# EAGLE design clock_v0.3 (EAGLE 9.5.0)
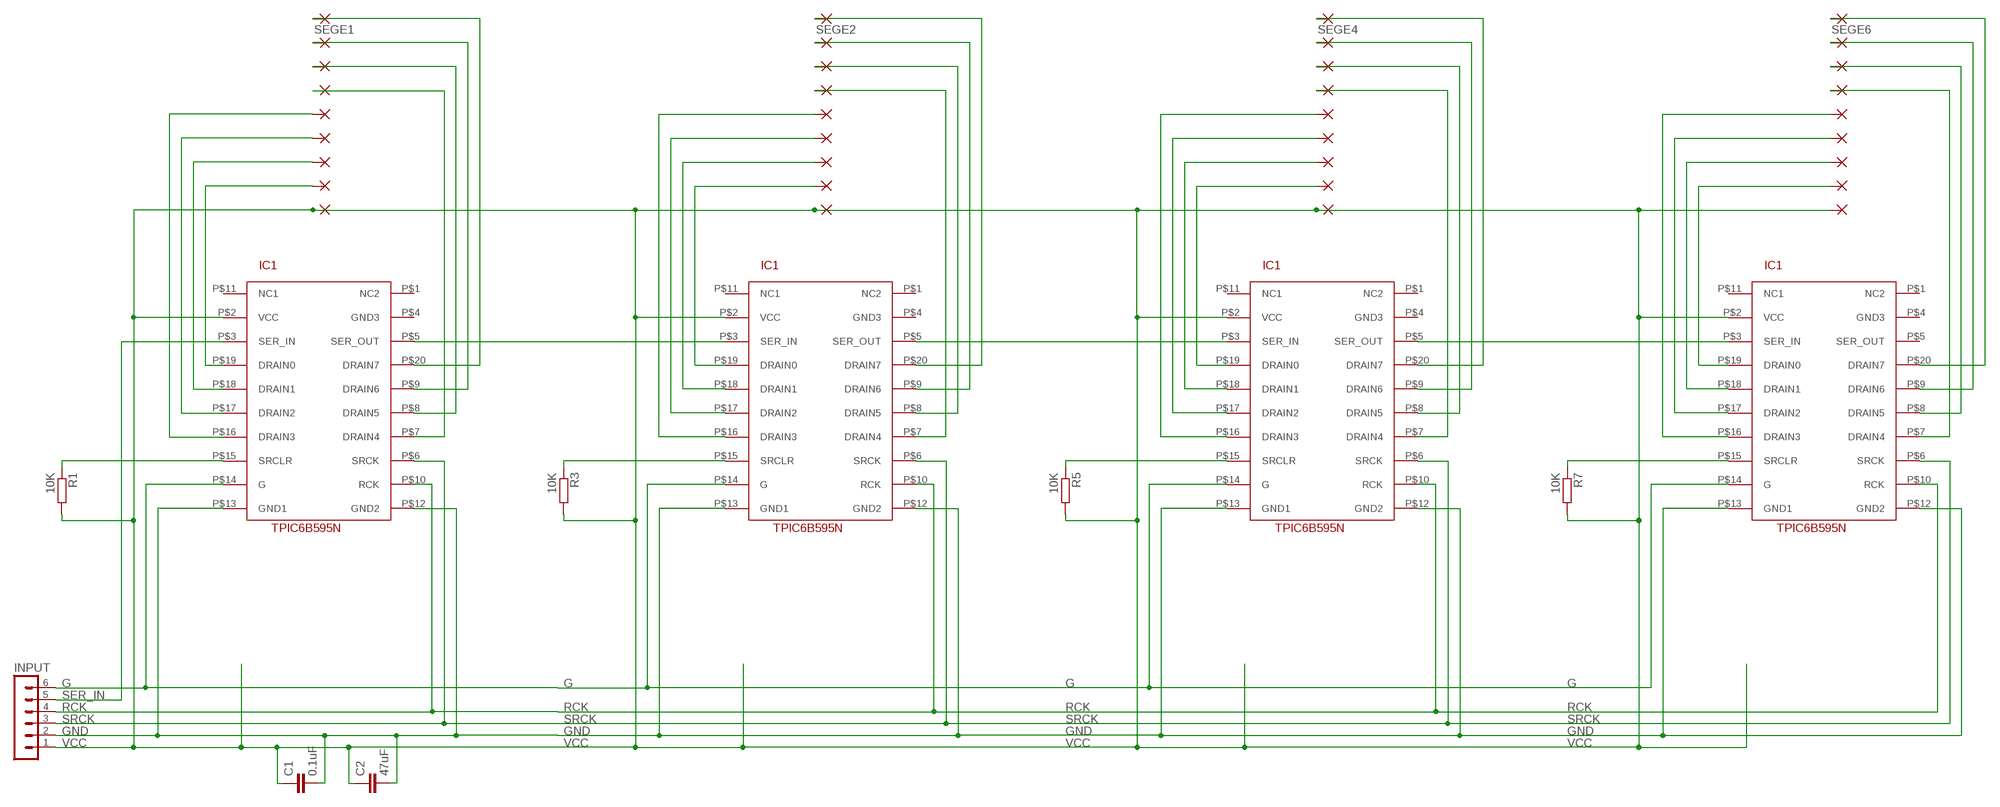
[diagram p0: schematic, sheet 1]

## Parts
C1  0.1uF  RCL_C-EU025-025X050  [RCL_C025-025X050]
C2  47uF  RCL_C-EU025-025X050  [RCL_C025-025X050]
DEC1  1,6/0,8  [1,6/0,8]
DEC2  1,6/0,8  [1,6/0,8]
DEC4  1,6/0,8  [1,6/0,8]
DEC6  1,6/0,8  [1,6/0,8]
INPUT  CON-LSTB_MA06-1  [CON-LSTB_MA06-1]
R1  10K  RCL_R-EU_0207/7  [RCL_0207/7]
R3  10K  RCL_R-EU_0207/7  [RCL_0207/7]
R5  10K  RCL_R-EU_0207/7  [RCL_0207/7]
R7  10K  RCL_R-EU_0207/7  [RCL_0207/7]
SEGA1  1,6/0,8  [1,6/0,8]
SEGA2  1,6/0,8  [1,6/0,8]
SEGA4  1,6/0,8  [1,6/0,8]
SEGA6  1,6/0,8  [1,6/0,8]
SEGB1  1,6/0,8  [1,6/0,8]
SEGB2  1,6/0,8  [1,6/0,8]
SEGB4  1,6/0,8  [1,6/0,8]
SEGB6  1,6/0,8  [1,6/0,8]
SEGC1  1,6/0,8  [1,6/0,8]
SEGC2  1,6/0,8  [1,6/0,8]
SEGC4  1,6/0,8  [1,6/0,8]
SEGC6  1,6/0,8  [1,6/0,8]
SEGD1  1,6/0,8  [1,6/0,8]
SEGD2  1,6/0,8  [1,6/0,8]
SEGD4  1,6/0,8  [1,6/0,8]
SEGD6  1,6/0,8  [1,6/0,8]
SEGE1  1,6/0,8  [1,6/0,8]
SEGE2  1,6/0,8  [1,6/0,8]
SEGE4  1,6/0,8  [1,6/0,8]
SEGE6  1,6/0,8  [1,6/0,8]
SEGF1  1,6/0,8  [1,6/0,8]
SEGF2  1,6/0,8  [1,6/0,8]
SEGF4  1,6/0,8  [1,6/0,8]
SEGF6  1,6/0,8  [1,6/0,8]
SEGG1  1,6/0,8  [1,6/0,8]
SEGG2  1,6/0,8  [1,6/0,8]
SEGG4  1,6/0,8  [1,6/0,8]
SEGG6  1,6/0,8  [1,6/0,8]
U$1  TPIC6B595N_TPIC6B595NPDIP-20  [TPIC6B595N_PDIP-20]
U$3  TPIC6B595N_TPIC6B595NPDIP-20  [TPIC6B595N_PDIP-20]
U$5  TPIC6B595N_TPIC6B595NPDIP-20  [TPIC6B595N_PDIP-20]
U$7  TPIC6B595N_TPIC6B595NPDIP-20  [TPIC6B595N_PDIP-20]
VCC1  1,6/0,8  [1,6/0,8]
VCC2  1,6/0,8  [1,6/0,8]
VCC4  1,6/0,8  [1,6/0,8]
VCC6  1,6/0,8  [1,6/0,8]

## Nets
G: INPUT.6 U$1.P$14(G) U$3.P$14(G) U$5.P$14(G) U$7.P$14(G)
GND [ground]: C1.2 C2.2 INPUT.2 U$1.P$12(GND2) U$1.P$13(GND1) U$3.P$12(GND2) U$3.P$13(GND1) U$5.P$12(GND2) U$5.P$13(GND1) U$7.P$12(GND2) U$7.P$13(GND1)
N$1: R1.1 U$1.P$15(SRCLR)
N$2: U$1.P$19(DRAIN0) VCC1.1(P)
N$3: DEC1.1(P) U$1.P$18(DRAIN1)
N$4: SEGB1.1(P) U$1.P$17(DRAIN2)
N$5: SEGC1.1(P) U$1.P$16(DRAIN3)
N$6: SEGA1.1(P) U$1.P$7(DRAIN4)
N$7: SEGF1.1(P) U$1.P$8(DRAIN5)
N$8: SEGG1.1(P) U$1.P$9(DRAIN6)
N$9: SEGE1.1(P) U$1.P$20(DRAIN7)
N$10: U$1.P$5(SER_OUT) U$3.P$3(SER_IN)
N$11: U$3.P$5(SER_OUT) U$5.P$3(SER_IN)
N$12: U$5.P$5(SER_OUT) U$7.P$3(SER_IN)
N$19: R3.1 U$3.P$15(SRCLR)
N$20: U$3.P$19(DRAIN0) VCC2.1(P)
N$21: DEC2.1(P) U$3.P$18(DRAIN1)
N$22: SEGB2.1(P) U$3.P$17(DRAIN2)
N$23: SEGC2.1(P) U$3.P$16(DRAIN3)
N$24: SEGA2.1(P) U$3.P$7(DRAIN4)
N$25: SEGF2.1(P) U$3.P$8(DRAIN5)
N$26: SEGG2.1(P) U$3.P$9(DRAIN6)
N$27: SEGE2.1(P) U$3.P$20(DRAIN7)
N$37: R5.1 U$5.P$15(SRCLR)
N$38: U$5.P$19(DRAIN0) VCC4.1(P)
N$39: DEC4.1(P) U$5.P$18(DRAIN1)
N$40: SEGB4.1(P) U$5.P$17(DRAIN2)
N$41: SEGC4.1(P) U$5.P$16(DRAIN3)
N$42: SEGA4.1(P) U$5.P$7(DRAIN4)
N$43: SEGF4.1(P) U$5.P$8(DRAIN5)
N$44: SEGG4.1(P) U$5.P$9(DRAIN6)
N$45: SEGE4.1(P) U$5.P$20(DRAIN7)
N$55: R7.1 U$7.P$15(SRCLR)
N$56: U$7.P$19(DRAIN0) VCC6.1(P)
N$57: DEC6.1(P) U$7.P$18(DRAIN1)
N$58: SEGB6.1(P) U$7.P$17(DRAIN2)
N$59: SEGC6.1(P) U$7.P$16(DRAIN3)
N$60: SEGA6.1(P) U$7.P$7(DRAIN4)
N$61: SEGF6.1(P) U$7.P$8(DRAIN5)
N$62: SEGG6.1(P) U$7.P$9(DRAIN6)
N$63: SEGE6.1(P) U$7.P$20(DRAIN7)
RCK: INPUT.4 U$1.P$10(RCK) U$3.P$10(RCK) U$5.P$10(RCK) U$7.P$10(RCK)
SER_IN: INPUT.5 U$1.P$3(SER_IN)
SRCK: INPUT.3 U$1.P$6(SRCK) U$3.P$6(SRCK) U$5.P$6(SRCK) U$7.P$6(SRCK)
VCC [vcc]: C1.1 C2.1 INPUT.1 R1.2 R3.2 R5.2 R7.2 SEGD1.1(P) SEGD2.1(P) SEGD4.1(P) SEGD6.1(P) U$1.P$2(VCC) U$3.P$2(VCC) U$5.P$2(VCC) U$7.P$2(VCC)
Unconnected: U$1.P$1(NC2) U$1.P$4(GND3) U$1.P$11(NC1) U$3.P$1(NC2) U$3.P$4(GND3) U$3.P$11(NC1) U$5.P$1(NC2) U$5.P$4(GND3) U$5.P$11(NC1) U$7.P$1(NC2) U$7.P$4(GND3) U$7.P$5(SER_OUT) U$7.P$11(NC1)

## Library data of the parts
C1 C2 = v0.4:RCL_C-EU: CAPACITOR, European symbol; SPICEPREFIX: C
DEC1 DEC2 DEC4 DEC6 SEGA1 SEGA2 SEGA4 SEGA6 SEGB1 SEGB2 SEGB4 SEGB6 SEGC1 SEGC2 SEGC4 SEGC6 SEGD1 SEGD2 SEGD4 SEGD6 SEGE1 SEGE2 SEGE4 SEGE6 SEGF1 SEGF2 SEGF4 SEGF6 SEGG1 SEGG2 SEGG4 SEGG6 VCC1 VCC2 VCC4 VCC6 = wirepad:1,6/0,8: THROUGH-HOLE PAD
INPUT = v0.4:CON-LSTB_MA06-1: PIN HEADER; OC_FARNELL: unknown; OC_NEWARK: unknown
R1 R3 R5 R7 = v0.4:RCL_R-EU_: RESISTOR, European symbol; SPICEPREFIX: R
U$1 U$3 U$5 U$7 = v0.4:TPIC6B595N_TPIC6B595N

## Net classes
0 default: width 0.635 mm
1 vcc: width 1.27 mm
2 ground: width 1.27 mm

## Board
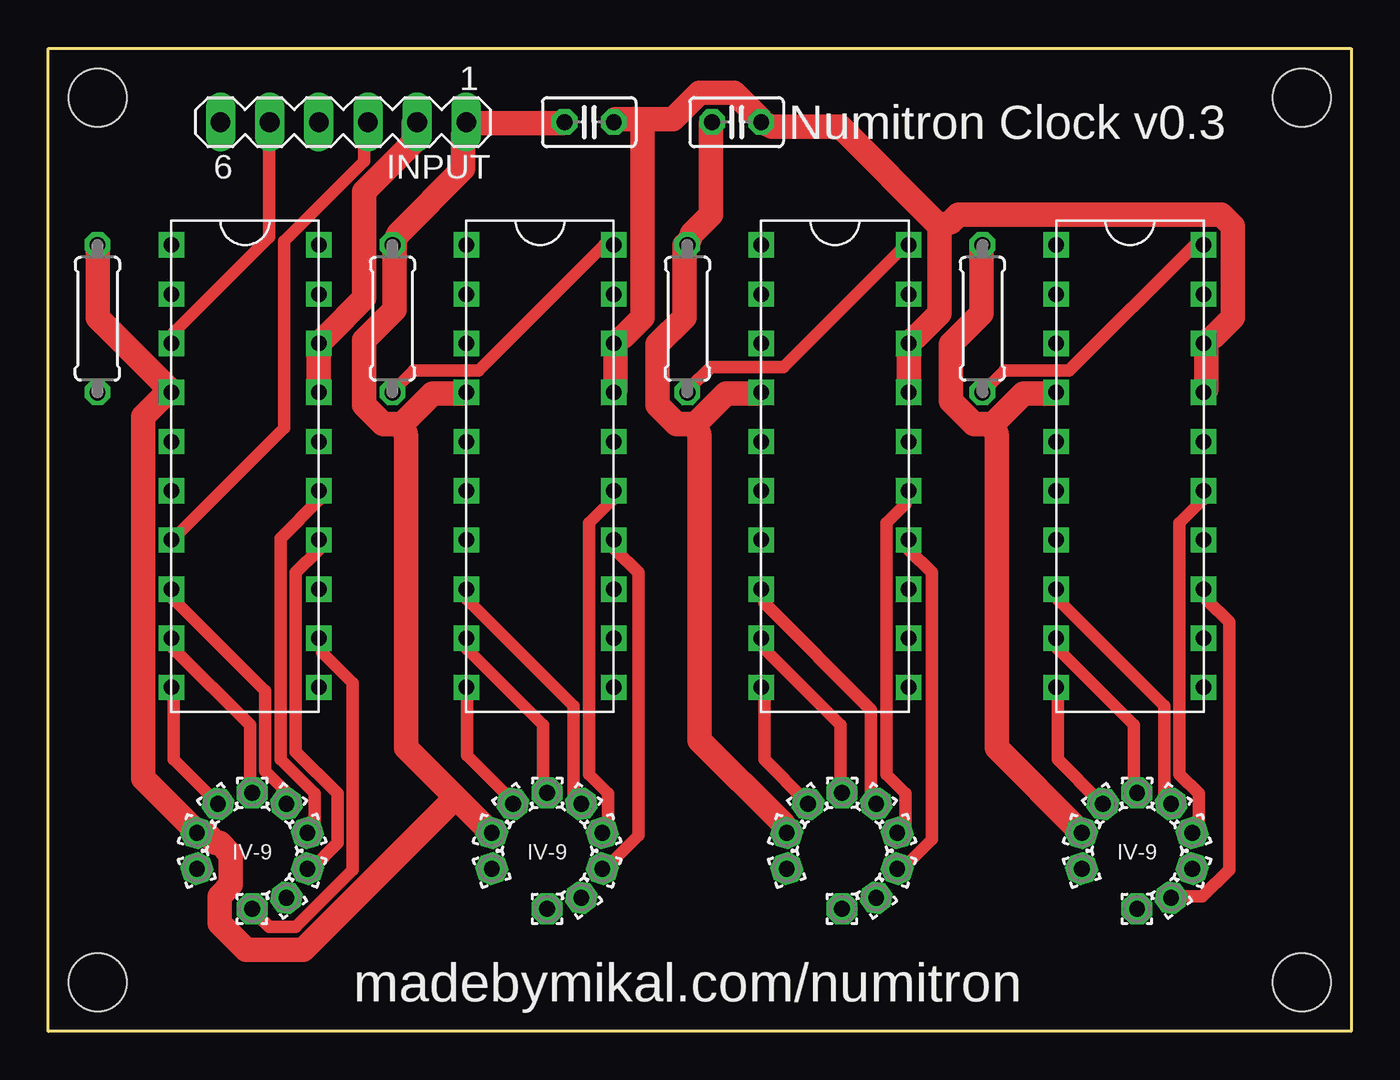
[diagram p1: board, top side]
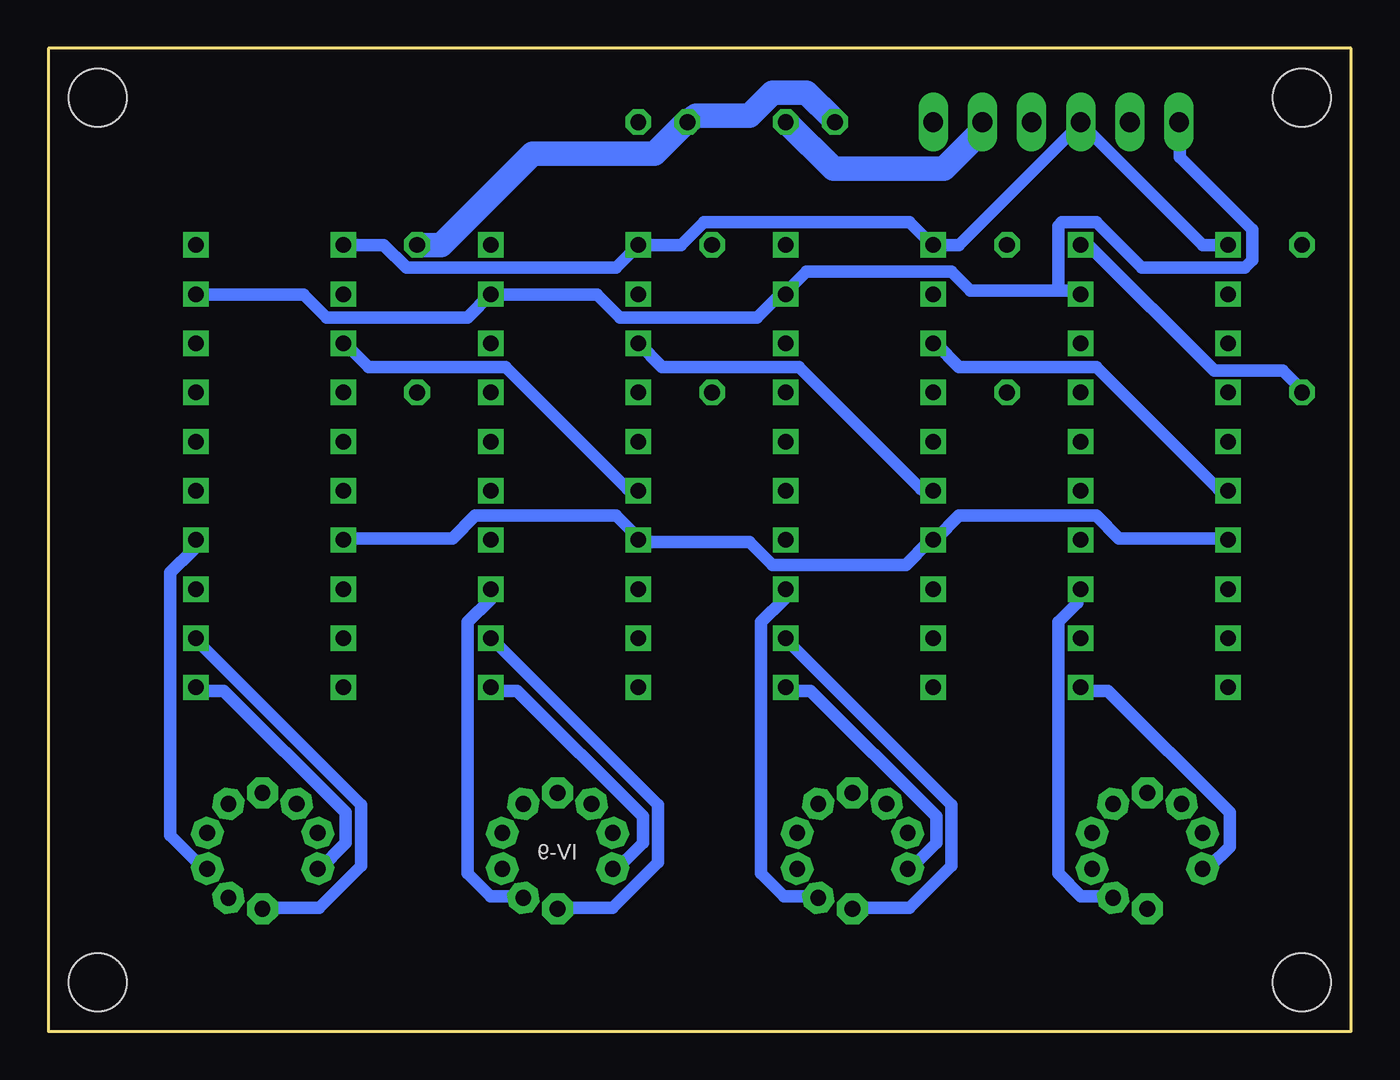
[diagram p2: board, bottom side, seen from below]

Size 67.31 x 50.8 mm. Coordinates in mm from the lower left corner, seen from the top.
Outline: 0,0 0,50.8 67.31,50.8 67.31,0 0,0
Copper layers (1*16): Top 0.035mm / dielectric 1.5mm / Bottom 0.035mm
Design rules "default": minimum track width 6mil, minimum drill 0.35mm, track to track 6mil, track to pad 6mil, pad to pad 6mil, via to via 6mil, smd to smd 6mil, copper to edge 40mil, drill to drill 6mil, minimum pad ring 10mil, minimum via ring 8mil, stop-mask expansion 4mil, vias tented up to drill 0mil, thermal gap 10mil
Holes 3 mm at 2.54,2.54 2.54,48.26 64.77,2.54 64.77,48.26

### Footprints (pad centres in the part's own frame; a part is rotated, then mirrored left to right if it is on the bottom)
RCL_C025-025X050 = drill 0.813 octagon: 1 -1.27,0; 2 1.27,0
1,6/0,8 = drill 0.813 pad 1.6 octagon: 1 0,0
CON-LSTB_MA06-1 = drill 1.016 long: 1 -6.35,0; 2 -3.81,0; 3 -1.27,0; 4 1.27,0; 5 3.81,0; 6 6.35,0
RCL_0207/7 = drill 0.813 octagon: 1 -3.81,0; 2 3.81,0
TPIC6B595N_PDIP-20 = drill 0.8 square: P$1 -3.81,1.27; P$2 -3.81,3.81; P$3 -3.81,6.35; P$4 -3.81,8.89; P$5 -3.81,-1.27; P$6 -3.81,-3.81; P$7 -3.81,-6.35; P$8 -3.81,-8.89; P$9 -3.81,-11.43; P$10 -3.81,11.43; P$11 3.81,1.27; P$12 3.81,3.81; P$13 3.81,6.35; P$14 3.81,8.89; P$15 3.81,11.43; P$16 3.81,-1.27; P$17 3.81,-3.81; P$18 3.81,-6.35; P$19 3.81,-8.89; P$20 3.81,-11.43

### Placement (x,y rotation side)
C1  35.56,46.99 0 top
C2  27.94,46.99 0 top
DEC1  12.29,6.91 306 top
DEC2  27.53,6.91 306 top
DEC4  42.77,6.91 306 top
DEC6  58.01,6.91 306 top
INPUT  15.24,46.99 180 top
R1  2.54,36.83 90 top
R3  17.78,36.83 90 top
R5  33.02,36.83 90 top
R7  48.26,36.83 90 top
SEGA1  12.29,11.76 144 top
SEGA2  27.53,11.76 144 top
SEGA4  42.77,11.76 144 top
SEGA6  58.01,11.76 144 top
SEGB1  13.38,8.41 342 top
SEGB2  28.62,8.41 342 top
SEGB4  43.86,8.41 342 top
SEGB6  59.1,8.41 342 top
SEGC1  13.38,10.26 18 top
SEGC2  28.62,10.26 18 top
SEGC4  43.86,10.26 18 top
SEGC6  59.1,10.26 18 top
SEGD1  7.67,10.26 162 top
SEGD2  22.91,10.26 162 top
SEGD4  38.15,10.26 162 top
SEGD6  53.39,10.26 162 top
SEGE1  7.67,8.41 198 top
SEGE2  22.91,8.41 198 top
SEGE4  38.15,8.41 198 top
SEGE6  53.39,8.41 198 top
SEGF1  10.53,12.33 90 top
SEGF2  25.77,12.33 90 top
SEGF4  41.01,12.33 90 top
SEGF6  56.25,12.33 90 top
SEGG1  8.76,11.76 126 top
SEGG2  24,11.76 126 top
SEGG4  39.24,11.76 126 top
SEGG6  54.48,11.76 126 top
U$1  10.16,29.21 0 top
U$3  25.4,29.21 0 top
U$5  40.64,29.21 0 top
U$7  55.88,29.21 0 top
VCC1  10.53,6.33 270 top
VCC2  25.77,6.33 270 top
VCC4  41.01,6.33 270 top
VCC6  56.25,6.33 270 top

### Tracks (layer width: path | path; a pad name or v marks a point on that pad's centre or on a via)
G
  Bottom 0.635: 15.14,38.28 19.67,38.28 20.65,39.26 28.13,39.26 29.11,38.28 U$3.P$14 29.51,38.08 30.69,36.9 37.78,36.9 38.96,38.08 44.27,38.08 U$5.P$14 45.65,36.9 52.93,36.9 54.12,38.08 59.63,38.08 U$7.P$14 | 15.14,38.28 14.15,38.28 U$1.P$14 | 15.14,38.28 15.14,41.62 14.94,41.82 13.17,41.82 10.81,39.46 5.49,39.46 5.1,39.85 5.1,41.43 8.84,45.17 8.84,46.94 INPUT.6
GND
  Top 1.27: U$7.P$12 59.82,33.16 59.82,35.52 U$7.P$13 60.22,35.92 61.2,36.9 61.2,41.62 60.61,42.22 47.03,42.22 46.63,41.82 46.04,41.62 | U$5.P$12 44.47,33.16 44.47,35.52 U$5.P$13 44.86,35.92 46.04,37.1 46.04,41.62 | U$3.P$12 29.31,33.16 29.31,35.52 U$3.P$13 29.7,35.92 30.69,36.9 30.69,47.14 | U$1.P$12 13.96,33.16 13.96,35.52 U$1.P$13 14.35,35.92 16.32,37.88 16.32,43.4 18.88,45.96 18.88,46.94 INPUT.2 | 30.69,47.14 32.26,47.14 33.64,48.51 35.41,48.51 36.79,47.14 C1.2 37.38,46.74 40.93,46.74 46.04,41.62 | 30.69,47.14 29.31,47.14 C2.2
  Bottom 1.27: INPUT.2 19.07,46.94 19.07,46.55 21.04,44.58 26.75,44.58 29.11,46.94 C2.2
N$1
  Bottom 0.635: U$1.P$15 13.56,40.64 7.07,34.14 3.52,34.14 2.54,33.16 R1.1
N$2
  Top 0.635: U$1.P$19 14.15,20.17 14.15,19.58 15.73,18 15.73,8.36 12.78,5.4 11.4,5.4 10.61,6.19 VCC1.1
N$3
  Bottom 0.635: U$1.P$18 14.15,22.73 14.15,22.14 15.14,21.15 15.14,8.16 13.96,6.98 12.38,6.98 DEC1.1
N$4
  Top 0.635: U$1.P$17 13.96,25.29 13.96,24.89 12.78,23.71 12.78,14.46 14.94,12.29 14.94,9.73 13.56,8.36 SEGB1.1
N$5
  Top 0.635: U$1.P$16 13.96,27.84 13.96,27.45 11.99,25.48 11.99,14.06 13.76,12.29 13.76,10.52 13.56,10.32 SEGC1.1
N$6
  Top 0.635: U$1.P$7 6.48,22.73 6.48,22.33 11.2,17.61 11.2,13.47 12.19,12.49 12.19,11.9 SEGA1.1
N$7
  Top 0.635: U$1.P$8 6.48,20.17 6.48,19.77 10.41,15.84 10.41,12.49 SEGF1.1
N$8
  Top 0.635: U$1.P$9 6.48,17.61 6.48,14.06 8.64,11.9 SEGG1.1
N$9
  Bottom 0.635: U$1.P$20 13.96,17.61 12.58,17.61 6.28,11.31 6.28,9.54 7.26,8.55 7.66,8.55 SEGE1.1
N$10
  Bottom 0.635: U$1.P$5 6.48,28.04 6.87,28.04 13.17,34.34 20.26,34.34 21.44,35.52 U$3.P$3
N$11
  Bottom 0.635: U$5.P$3 35.61,34.34 28.52,34.34 22.22,28.04 21.63,28.04 U$3.P$5
N$12
  Bottom 0.635: U$5.P$5 36.99,28.04 37.38,28.04 43.68,34.34 50.77,34.34 51.95,35.52 U$7.P$3
N$19
  Top 0.635: U$3.P$15 28.72,40.64 22.22,34.14 18.88,34.14 17.89,33.16 R3.1
N$20
  Bottom 0.635: U$3.P$19 29.11,20.17 20.65,11.7 20.65,8.55 22.82,6.39 25.57,6.39 VCC2.1
N$21
  Bottom 0.635: U$3.P$18 29.31,22.73 29.31,22.33 30.49,21.15 30.49,8.16 29.31,6.98 27.54,6.98 DEC2.1
N$22
  Top 0.635: U$3.P$17 29.31,25.29 29.31,24.89 30.49,23.71 30.49,10.13 28.72,8.36 SEGB2.1
N$23
  Top 0.635: U$3.P$16 29.11,27.84 29.11,27.45 27.93,26.27 27.93,13.28 28.92,12.29 28.92,10.52 28.72,10.32 SEGC2.1
N$24
  Top 0.635: U$3.P$7 21.63,22.73 21.63,22.33 27.15,16.82 27.15,12.1 27.34,11.9 SEGA2.1
N$25
  Top 0.635: U$3.P$8 21.63,20.17 21.63,19.77 25.57,15.84 25.57,12.49 SEGF2.1
N$26
  Top 0.635: U$3.P$9 21.63,17.61 21.63,14.26 24,11.9 SEGG2.1
N$27
  Bottom 0.635: U$3.P$20 29.11,17.61 27.93,17.61 21.44,11.11 21.44,9.73 22.82,8.36 SEGE2.1
N$37
  Top 0.635: U$5.P$15 44.27,40.64 37.97,34.34 34.23,34.34 33.05,33.16 R5.1
N$38
  Bottom 0.635: U$5.P$19 44.27,20.17 35.81,11.7 35.81,8.75 38.17,6.39 40.93,6.39 VCC4.1
N$39
  Bottom 0.635: U$5.P$18 44.47,22.73 44.47,22.33 45.65,21.15 45.65,8.16 44.47,6.98 42.89,6.98 DEC4.1
N$40
  Top 0.635: U$5.P$17 44.47,25.29 44.47,24.89 45.65,23.71 45.65,9.93 44.27,8.55 43.88,8.55 SEGB4.1
N$41
  Top 0.635: U$5.P$16 44.27,27.84 44.27,27.25 43.29,26.27 43.29,13.28 44.27,12.29 44.27,10.72 43.88,10.32 SEGC4.1
N$42
  Top 0.635: U$5.P$7 36.99,22.73 36.99,22.14 42.5,16.62 42.5,12.1 42.7,11.9 SEGA4.1
N$43
  Top 0.635: U$5.P$8 36.99,20.17 36.99,19.77 40.93,15.84 40.93,12.49 SEGF4.1
N$44
  Top 0.635: U$5.P$9 36.99,17.61 36.99,14.06 39.15,11.9 SEGG4.1
N$45
  Bottom 0.635: U$5.P$20 44.27,17.61 43.09,17.61 36.59,11.11 36.59,9.73 37.97,8.36 SEGE4.1
N$55
  Top 0.635: U$7.P$15 59.23,40.64 52.74,34.14 49.39,34.14 48.41,33.16 R7.1
N$56
  Bottom 0.635: U$7.P$19 59.63,20.17 51.16,11.7 51.16,8.55 53.33,6.39 56.08,6.39 VCC6.1
N$57
  Top 0.635: U$7.P$18 59.82,22.73 59.82,22.33 61,21.15 61,8.36 59.63,6.98 58.05,6.98 DEC6.1
N$58
  Bottom 0.635: U$7.P$17 59.82,25.29 59.82,24.89 61,23.71 61,10.13 59.23,8.36 SEGB6.1
N$59
  Top 0.635: U$7.P$16 59.63,27.84 59.63,27.45 58.45,26.27 58.45,13.28 59.43,12.29 59.43,10.52 59.23,10.32 SEGC6.1
N$60
  Top 0.635: U$7.P$7 52.15,22.73 52.15,22.33 57.66,16.82 57.66,12.1 57.85,11.9 SEGA6.1
N$61
  Top 0.635: U$7.P$8 52.15,20.17 52.15,19.77 56.08,15.84 56.08,12.49 SEGF6.1
N$62
  Top 0.635: U$7.P$9 52.15,17.61 52.15,14.06 54.31,11.9 SEGG6.1
N$63
  Bottom 0.635: U$7.P$20 59.63,17.61 58.25,17.61 51.95,11.31 51.95,9.73 53.33,8.36 SEGE6.1
RCK
  Bottom 0.635: U$1.P$10 7.66,40.64 13.96,46.94 INPUT.4 14.15,46.74 20.26,40.64 U$3.P$10 21.83,40.84 22.82,41.82 33.45,41.82 34.63,40.64 U$5.P$10 36.99,40.44 37.97,39.46 48.8,39.46 49.98,40.64 U$7.P$10
SER_IN
  Top 0.635: U$1.P$3 6.48,35.72 6.48,36.11 11.4,41.03 11.4,46.94 INPUT.5
SRCK
  Top 0.635: INPUT.3 16.32,46.94 16.32,44.97 12.19,40.84 12.19,31.19 6.48,25.48 U$1.P$6
  Bottom 0.635: U$1.P$6 6.48,25.48 11.99,25.48 13.17,26.66 20.26,26.66 21.44,25.48 U$3.P$6 21.83,25.29 23.01,24.11 29.9,24.11 31.08,25.29 36.79,25.29 U$5.P$6 36.99,25.68 37.97,26.66 45.26,26.66 46.44,25.48 51.95,25.48 U$7.P$6
VCC
  Top 1.27: 48.8,31.39 50.38,32.96 51.95,32.96 U$7.P$2 | 48.8,31.39 47.82,31.39 46.63,32.57 46.63,35.52 48.21,37.1 48.21,40.64 R7.2 | SEGD6.1 53.33,10.32 49,14.66 49,30.8 48.8,31.39 | 33.45,31.39 35.02,32.96 36.79,32.96 U$5.P$2 | 33.45,31.39 32.46,31.39 31.48,32.37 31.48,35.52 32.86,36.9 32.86,40.64 R5.2 33.25,41.23 34.23,42.22 34.23,46.94 C1.1 | SEGD4.1 37.97,10.32 37.97,10.72 33.64,15.05 33.64,30.8 33.45,31.39 | R1.2 2.54,36.9 6.28,33.16 U$1.P$2 5.89,32.77 4.9,31.78 4.9,13.08 7.66,10.32 SEGD1.1 8.25,10.13 8.64,9.73 8.84,9.73 9.43,9.14 9.43,7.57 8.84,6.98 8.84,5.6 10.22,4.22 13.17,4.22 21.04,12.1 | C2.1 26.56,46.94 21.63,46.94 INPUT.1 21.44,46.35 21.44,44.58 18.09,41.23 R3.2 17.89,40.64 17.89,37.29 16.32,35.72 16.32,32.37 17.3,31.39 18.29,31.39 | 18.29,31.39 19.86,32.96 21.44,32.96 U$3.P$2 | 21.04,12.1 18.48,14.66 18.48,30.8 18.29,31.39 | 21.04,12.1 22.82,10.32 SEGD2.1
  Bottom 1.27: R7.2 47.03,40.64 42.3,45.36 36.01,45.36 34.43,46.94 C1.1 33.84,47.33 31.08,47.33 29.9,48.51 28.13,48.51 26.75,47.14 C2.1

### Text on the board
tPlace: Numitron Clock v0.3 | IV-9 | IV-9 | IV-9 | madebymikal.com/numitron
bPlace: IV-9